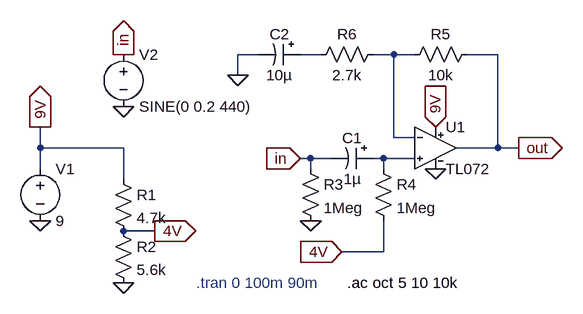
[diagram p0: schematic OC2-input-stage.asc]
OC2-input-stage.asc, the LTspice schematic file:
Version 4
SHEET 1 880 680
WIRE 80 176 48 176
WIRE 176 176 144 176
WIRE 288 176 256 176
WIRE 320 176 288 176
WIRE 448 176 400 176
WIRE 48 208 48 176
WIRE 288 304 288 176
WIRE 320 304 288 304
WIRE -256 320 -256 288
WIRE -128 320 -256 320
WIRE 448 320 448 176
WIRE 448 320 384 320
WIRE 480 320 448 320
WIRE 160 336 144 336
WIRE 192 336 160 336
WIRE 272 336 256 336
WIRE 320 336 272 336
WIRE -256 352 -256 320
WIRE 160 352 160 336
WIRE 272 352 272 336
WIRE -128 368 -128 320
WIRE -80 448 -128 448
WIRE 272 480 272 432
WIRE 272 480 208 480
FLAG -128 528 0
FLAG -256 432 0
FLAG -256 288 9V
IOPIN -256 288 Out
FLAG -80 448 4V
IOPIN -80 448 Out
FLAG 352 352 0
FLAG 352 288 9V
IOPIN 352 288 In
FLAG 144 336 in
IOPIN 144 336 In
FLAG 160 432 0
FLAG 208 480 4V
IOPIN 208 480 In
FLAG 48 208 0
FLAG 480 320 out
IOPIN 480 320 Out
FLAG -128 256 0
FLAG -128 176 in
IOPIN -128 176 Out
SYMBOL TL072 352 256 R0
SYMATTR InstName U1
SYMBOL Voltage -256 336 R0
SYMATTR InstName V1
SYMATTR Value 9
SYMBOL Res -144 352 R0
SYMATTR InstName R1
SYMATTR Value 4.7k
SYMBOL Res -144 432 R0
SYMATTR InstName R2
SYMATTR Value 5.6k
SYMBOL polcap 256 320 R90
WINDOW 0 0 32 VBottom 2
WINDOW 3 32 32 VTop 2
SYMATTR InstName C1
SYMATTR Value 1µ
SYMBOL Res 144 336 R0
SYMATTR InstName R3
SYMATTR Value 1Meg
SYMBOL Res 256 336 R0
SYMATTR InstName R4
SYMATTR Value 1Meg
SYMBOL Res 416 160 R90
WINDOW 0 0 56 VBottom 2
WINDOW 3 32 56 VTop 2
SYMATTR InstName R5
SYMATTR Value 10k
SYMBOL Res 272 160 R90
WINDOW 0 0 56 VBottom 2
WINDOW 3 32 56 VTop 2
SYMATTR InstName R6
SYMATTR Value 2.7k
SYMBOL polcap 144 160 R90
WINDOW 0 0 32 VBottom 2
WINDOW 3 32 32 VTop 2
SYMATTR InstName C2
SYMATTR Value 10µ
SYMBOL Voltage -128 160 R0
SYMATTR InstName V2
SYMATTR Value SINE(0 0.2 440)
SYMATTR Value2 AC 0.2
TEXT -16 528 Left 2 ;.tran 0 100m 90m
TEXT 216 528 Left 2 !.ac oct 5 10 10k

The netlist it stands for:
* OC2-input-stage.asc
XU1 N003 N002 9V 0 out TL072  ; pins In+ In- V+ V- OUT
V1 9V 0 9
R1 9V 4V 4.7k
R2 4V 0 5.6k
C1 N003 in 1µ
R3 in 0 1Meg
R4 N003 4V 1Meg
R5 out N002 10k
R6 N002 N001 2.7k
C2 N001 0 10µ
V2 in 0 SINE(0 0.2 440) AC 0.2
* .tran 0 100m 90m
.ac oct 5 10 10k
.lib TL072.sub
.backanno
.end